# EasyEDA schematic LcsNodes-Extension-Dual-Power-Module-L6205-A.01.05.json
TITLE: LcsNodes-Extension-Dual_power-Module-L6205; REV: A.01.05; Date: 2022-12-02; Sheet: 1/1; Drawn By: helmut-f; Company: Your Company
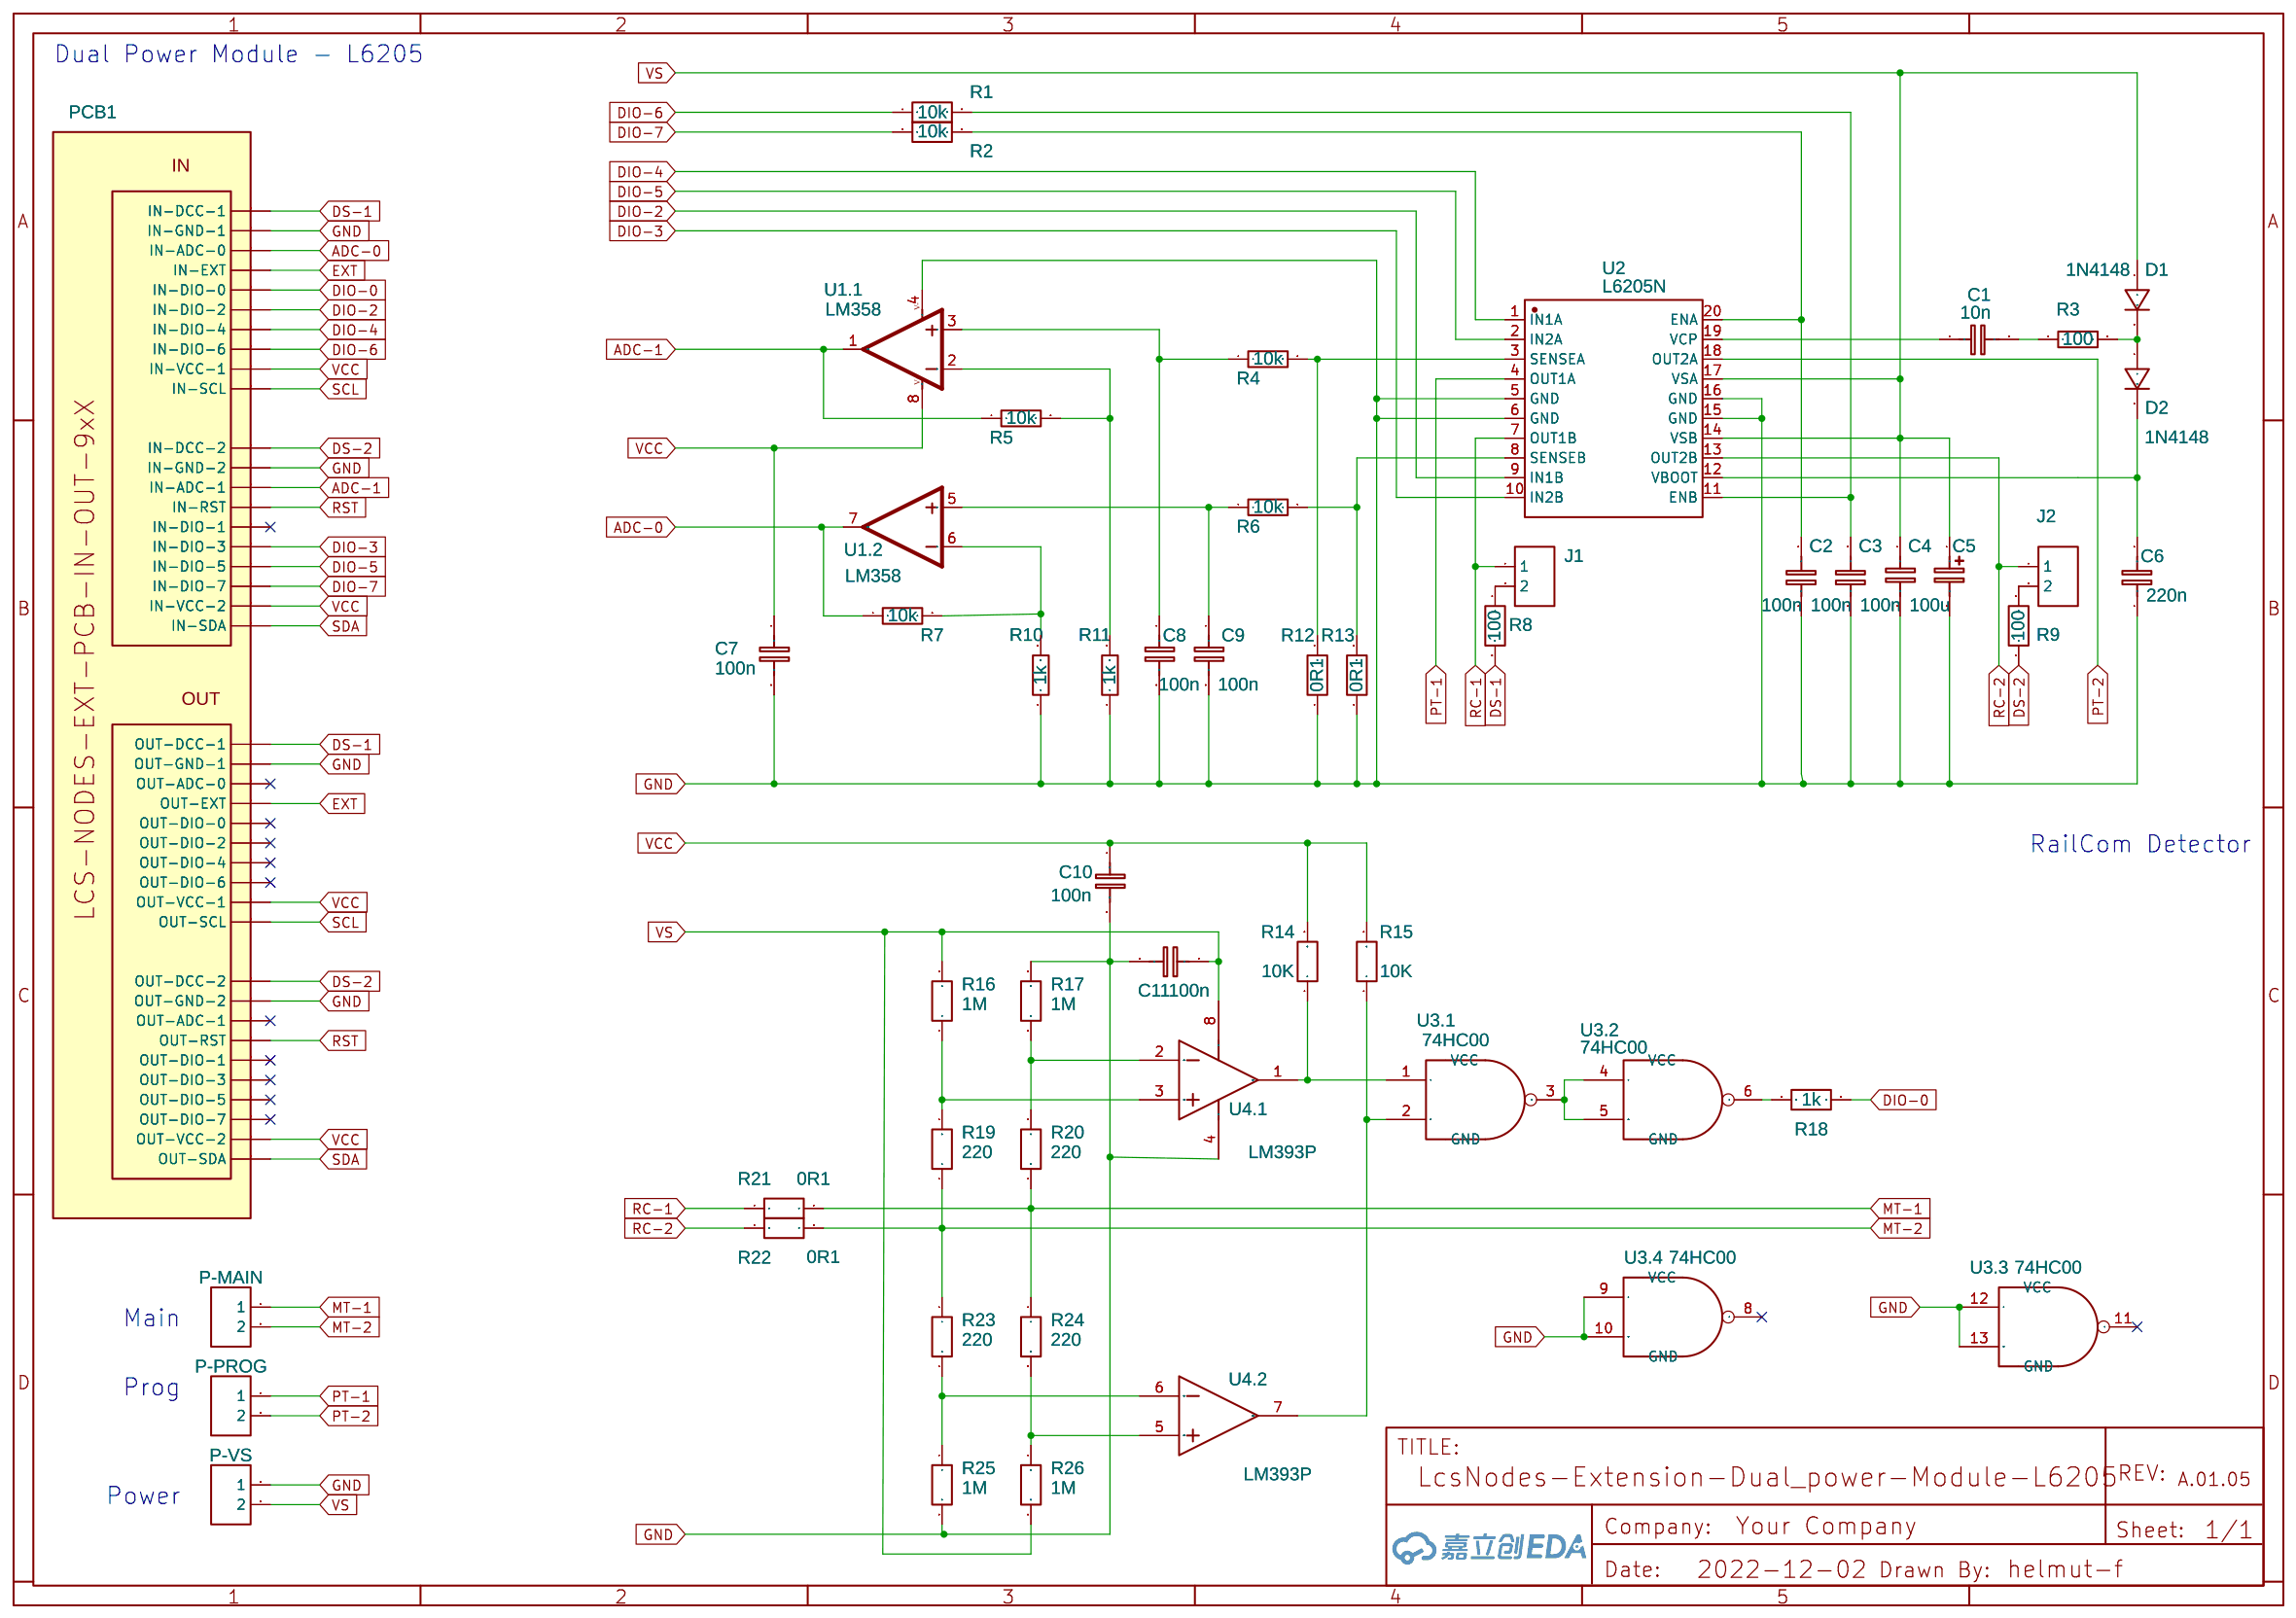
[diagram p0: schematic sheet]

## Parts
C1  10n  [RAD-0.1]
C2  100n  [RAD-0.1]
C3  100n  [RAD-0.1]
C4  100n  [RAD-0.1]
C5  100u  [CAP-D8.0-F3.5]
C6  220n  [RAD-0.1]
C7  100n  [RAD-0.1]
C8  100n  [RAD-0.1]
C9  100n  [RAD-0.1]
C10  100n  [RAD-0.1]
C11  100n  [RAD-0.1]
D1  1N4148  [DO-35_BD2.0-L4.0-P8.00-D0.5-FD]
D2  1N4148  [DO-35_BD2.0-L4.0-P8.00-D0.5-FD]
J1  HDR-M-2.54_1x2  [HDR-M-2.54_1X2]
J2  HDR-M-2.54_1x2  [HDR-M-2.54_1X2]
P-MAIN  CONN-TH_2P-P5.08  [CONN-TH_2P-P5.08]
P-PROG  CONN-TH_2P-P5.08  [CONN-TH_2P-P5.08]
P-VS  CONN-TH_2P-P5.08  [CONN-TH_2P-P5.08]
PCB1  LCS-NODES-EXT-PCB-IN-OUT-9xX  [LCS-NODES-EXT-PCB-IN-OUT-9X6]
R1  10k  [R_AXIAL-0.3]
R2  10k  [R_AXIAL-0.3]
R3  100  [R_AXIAL-0.3]
R4  10k  [R_AXIAL-0.3]
R5  10k  [R_AXIAL-0.3]
R6  10k  [R_AXIAL-0.3]
R7  10k  [R_AXIAL-0.3]
R8  100  [R_AXIAL-0.3]
R9  100  [R_AXIAL-0.3]
R10  1k  [R_AXIAL-0.3]
R11  1k  [R_AXIAL-0.3]
R12  0R1  [R_AXIAL-0.6]
R13  0R1  [R_AXIAL-0.6]
R14  10K  [R_AXIAL-0.3]
R15  10K  [R_AXIAL-0.3]
R16  1M  [R_AXIAL-0.3]
R17  1M  [R_AXIAL-0.3]
R18  1k  [R_AXIAL-0.3]
R19  220  [R_AXIAL-0.3]
R20  220  [R_AXIAL-0.3]
R21  0R1  [R_AXIAL-0.6]
R22  0R1  [R_AXIAL-0.6]
R23  220  [R_AXIAL-0.3]
R24  220  [R_AXIAL-0.3]
R25  1M  [R_AXIAL-0.3]
R26  1M  [R_AXIAL-0.3]
U1  LM358  [DIP-8_L10.1-W6.3-P2.54-LS7.6-BL]  (sections 1,2)
U2  L6205N  [PDIP-20_L24.5-W7.3-P2.54-LS7.9-BL]
U3  74HC00  [PDIP-14_L19.2-W6.4-P2.54-LS8.0-BL]  (sections 1,2,3,4)
U4  LM393P  [DIP-8_L10.1-W6.3-P2.54-LS7.6-BL]  (sections 1,2)

## Library data of the parts
C1-C4 C6 = C_0603_EU: Contributor: LCEDA_Lib
C5 = C_Tan_SMD_A_EU: Contributor: LCEDA_Lib
C7-C11 = C_0603_EU: Contributor: LCEDA_Lib; Package Display: No
D1 D2 = 1N4148: Supplier: LCSC; Manufacturer: SEMTECH; Supplier Part: C14516; Contributor: LCEDA_Lib
J1 J2 = HDR-M-2.54_1x2: Supplier Part: C124375; Supplier: LCSC; Contributor: LCEDA_Lib
P-MAIN P-PROG P-VS = CONN-TH_2P-P5.08: Supplier: LCSC; Contributor: LCEDA_Lib
PCB1 = LCS-NODES-EXT-PCB-IN-OUT-9xX: Contributor: helmut-f; Package Display: No
R1 R2 R8 R9 R14-R26 = R_AXIAL-0.3_EU: Contributor: LCEDA_Lib
R3-R7 R10 R11 = RESISTOR-AXIAL-0.1
R12 R13 = R_AXIAL-0.5_EU: Contributor: LCEDA_Lib
U1 = LM358: Contributor: SparkFun; subpart_no: 1
U2 = L6205N: Supplier: LCSC; Supplier Part: C962260; Manufacturer: STMicroelectronics; Contributor: LCSC
U3 = 74HC00: Contributor: David EL; subpart_no: 1
U4 = LM393P: Supplier: LCSC; Manufacturer: TI; image: //image.lceda.cn/szlcsc/C5209.jpg; Supplier Part: C5209; subpart_no: 1

## Nets
GND: C2.1 C3.1 C4.2 C5.2 C6.1 C7.2 C8.2 C9.2 C10.2 C11.2 P-VS.1 PCB1.3(IN-GND-1) PCB1.4(IN-GND-2) PCB1.23(OUT-GND-1) PCB1.24(OUT-GND-2) R10.1 R11.1 R12.1 R13.1 R17.2 R25.2 U1.4(V-) U2.5(GND) U2.6(GND) U2.15(GND) U2.16(GND) U3.9(A) U3.10(B) U3.12(A) U3.13(B) U4.4(GND)
VCC: C7.1 C10.1 PCB1.17(IN-VCC-1) PCB1.18(IN-VCC-2) PCB1.37(OUT-VCC-1) PCB1.38(OUT-VCC-2) R14.2 R15.2 U1.8(V+)
ADC-0: PCB1.5(IN-ADC-0) R7.1 U1.7(OUT)
ADC-1: PCB1.6(IN-ADC-1) R5.1 U1.1(OUT)
DIO-0: PCB1.9(IN-DIO-0) R18.1
DIO-2: PCB1.11(IN-DIO-2) U2.9(IN1B)
DIO-3: PCB1.12(IN-DIO-3) U2.10(IN2B)
DIO-4: PCB1.13(IN-DIO-4) U2.1(IN1A)
DIO-5: PCB1.14(IN-DIO-5) U2.2(IN2A)
DIO-6: PCB1.15(IN-DIO-6) R1.1
DIO-7: PCB1.16(IN-DIO-7) R2.1
DS-1: PCB1.1(IN-DCC-1) PCB1.21(OUT-DCC-1) R8.2
DS-2: PCB1.2(IN-DCC-2) PCB1.22(OUT-DCC-2) R9.1
EXT: PCB1.7(IN-EXT) PCB1.27(OUT-EXT)
MT-1: P-MAIN.1 R20.1 R21.2 R24.1
MT-2: P-MAIN.2 R19.1 R22.2 R23.1
PT-1: P-PROG.1 U2.4(OUT1A)
PT-2: P-PROG.2 U2.18(OUT2A)
RC-1: J1.1 R21.1 U2.7(OUT1B)
RC-2: J2.1 R22.1 U2.13(OUT2B)
RST: PCB1.8(IN-RST) PCB1.28(OUT-RST)
SCL: PCB1.19(IN-SCL) PCB1.39(OUT-SCL)
SDA: PCB1.20(IN-SDA) PCB1.40(OUT-SDA)
VS: C4.1 C5.1 C11.1 D1.1 P-VS.2 R16.2 R26.2 U2.14(VSB) U2.17(VSA) U4.8(VCC)
Net-(C1-1): C1.1 U2.19(VCP)
Net-(C1-2): C1.2 R3.1
Net-(C2-2): C2.2 R2.2 U2.20(ENA)
Net-(C3-2): C3.2 R1.2 U2.11(ENB)
Net-(C6-2): C6.2 D2.2 U2.12(VBOOT)
Net-(C8-1): C8.1 R4.1 U1.3(+IN)
Net-(C9-1): C9.1 R6.1 U1.5(+IN)
Net-(D1-2): D1.2 D2.1 R3.2
Net-(J1-2): J1.2 R8.1
Net-(J2-2): J2.2 R9.2
Net-(R4-2): R4.2 R12.2 U2.3(SENSEA)
Net-(R5-2): R5.2 R11.2 U1.2(-IN)
Net-(R6-2): R6.2 R13.2 U2.8(SENSEB)
Net-(R7-2): R7.2 R10.2 U1.6(-IN)
Net-(R14-1): R14.1 U3.1(A) U4.1(1OUT)
Net-(R15-1): R15.1 U3.2(B) U4.7(2OUT)
Net-(R16-1): R16.1 R19.2 U4.3(1IN+)
Net-(R17-1): R17.1 R20.2 U4.2(1IN-)
Net-(R18-2): R18.2 U3.6(Y)
Net-(R23-2): R23.2 R25.1 U4.6(2IN-)
Net-(R24-2): R24.2 R26.1 U4.5(2IN+)
Net-(U3.1-3): U3.3(Y) U3.4(A) U3.5(B)

Not connected (* = marked no-connect by the designer): PCB1 10(IN-DIO-1)* 25(OUT-ADC-0)* 26(OUT-ADC-1)* 29(OUT-DIO-0)* 30(OUT-DIO-1)* 31(OUT-DIO-2)* 32(OUT-DIO-3)* 33(OUT-DIO-4)* 34(OUT-DIO-5)* 35(OUT-DIO-6)* 36(OUT-DIO-7)*; U3 7(GND) 8(Y)* 11(Y)* 14(VCC)

## Notes on the sheet
- Dual Power Module - L6205
- RailCom Detector
- Main
- Prog
- Power
